# EAGLE design arduino-pro-mini_2-way-switches_v0.2.5_New-connector (EAGLE 7.2.0)
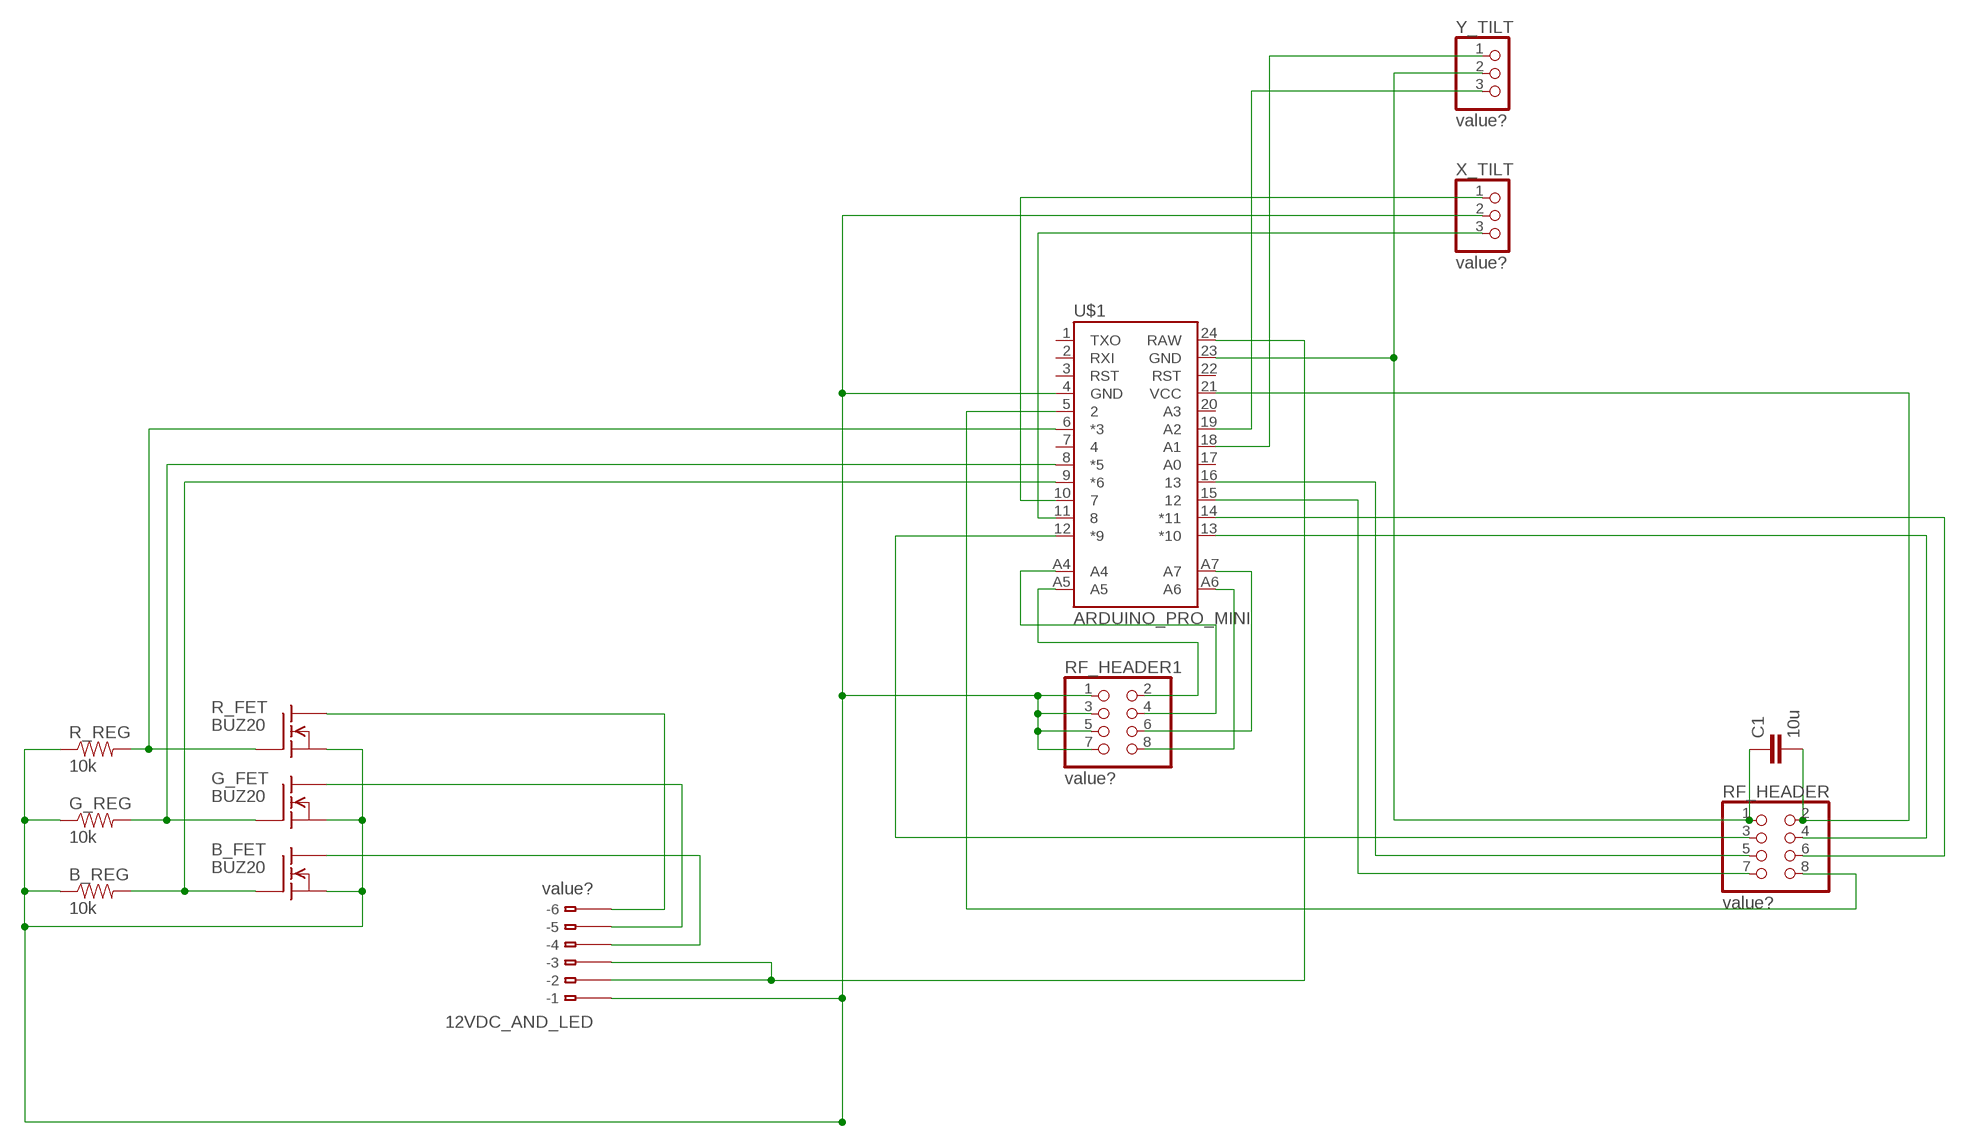
[diagram p0: schematic, sheet 1]

## Parts
12VDC_AND_LED  value?  234-206  [234-206]
B_FET  BUZ20  [TO220]
B_REG  10k  RESISTORPTH-1/4W  [AXIAL-0.4]
C1  10u  CAPPTH  [CAP-PTH-SMALL]
G_FET  BUZ20  [TO220]
G_REG  10k  RESISTORPTH-1/4W  [AXIAL-0.4]
R_FET  BUZ20  [TO220]
R_REG  10k  RESISTORPTH-1/4W  [AXIAL-0.4]
RF_HEADER  value?  PINHD-2X4  [2X04]
RF_HEADER1  value?  PINHD-2X4  [2X04]
U$1  ARDUINO_PRO_MINI  [ARDUINO_PRO_MINI]
X_TILT  value?  PINHD-1X3  [1X03]
Y_TILT  value?  PINHD-1X3  [1X03]

## Nets
N$1: U$1.10 X_TILT.1
N$2: B_FET.1(G) B_REG.P$2 U$1.9(*6)
N$3: R_FET.1(G) R_REG.P$2 U$1.6(*3)
N$4: 12VDC_AND_LED.B5(B-5) G_FET.2(D)
N$5: 12VDC_AND_LED.B4(B-4) B_FET.2(D)
N$6: U$1.11 X_TILT.3
N$7: 12VDC_AND_LED.B6(B-6) R_FET.2(D)
N$9: 12VDC_AND_LED.B2(B-2) 12VDC_AND_LED.B3(B-3) U$1.24(RAW)
N$10: C1.1 RF_HEADER.1 U$1.23(GND) Y_TILT.2
N$11: 12VDC_AND_LED.B1(B-1) B_FET.3(S) B_REG.P$1 G_FET.3(S) G_REG.P$1 R_FET.3(S) R_REG.P$1 RF_HEADER1.1 RF_HEADER1.3 RF_HEADER1.5 RF_HEADER1.7 U$1.4(GND) X_TILT.2
N$12: RF_HEADER1.4 U$1.A4
N$13: G_FET.1(G) G_REG.P$2 U$1.8(*5)
N$14: U$1.19(A2) Y_TILT.3
N$15: RF_HEADER.3 U$1.12(*9)
N$16: RF_HEADER.4 U$1.13(*10)
N$17: RF_HEADER.6 U$1.14(*11)
N$18: RF_HEADER1.2 U$1.A5
N$19: RF_HEADER1.8 U$1.A6
N$20: RF_HEADER1.6 U$1.A7
N$21: RF_HEADER.7 U$1.15
N$23: RF_HEADER.5 U$1.16
N$25: RF_HEADER.8 U$1.5
N$27: U$1.18(A1) Y_TILT.1
Y_TILT: C1.2 RF_HEADER.2 U$1.21(VCC)
Unconnected: 12VDC_AND_LED.A1(-1) 12VDC_AND_LED.A2(-2) 12VDC_AND_LED.A3(-3) 12VDC_AND_LED.A4(-4) 12VDC_AND_LED.A5(-5) 12VDC_AND_LED.A6(-6) U$1.1(TXO) U$1.2(RXI) U$1.3(RST) U$1.7 U$1.17(A0) U$1.20(A3) U$1.22(RST)

## Library data of the parts
12VDC_AND_LED = con-wago:234-206: WAGO Cage Clamp; MPN: 234-206; OC_FARNELL: unknown; OC_NEWARK: 28K9095
B_FET G_FET R_FET = transistor-fet:BUZ20: N-Channel Enhancement MOSFET 100V; 12A; 0,2Ohm
B_REG G_REG R_REG = SparkFun-Passives:RESISTOR: Resistor Basic schematic elements and footprints for 0603, 1206, and PTH resistors.
C1 = SparkFun-Passives:CAP: Capacitor Standard 0603 ceramic capacitor, and 0.1" leaded capacitor.
RF_HEADER RF_HEADER1 = rf-header:PINHD-2X4: PIN HEADER
U$1 = SparkFun-Boards:ARDUINO_PRO_MINI
X_TILT Y_TILT = pinhead:PINHD-1X3: PIN HEADER

## Board
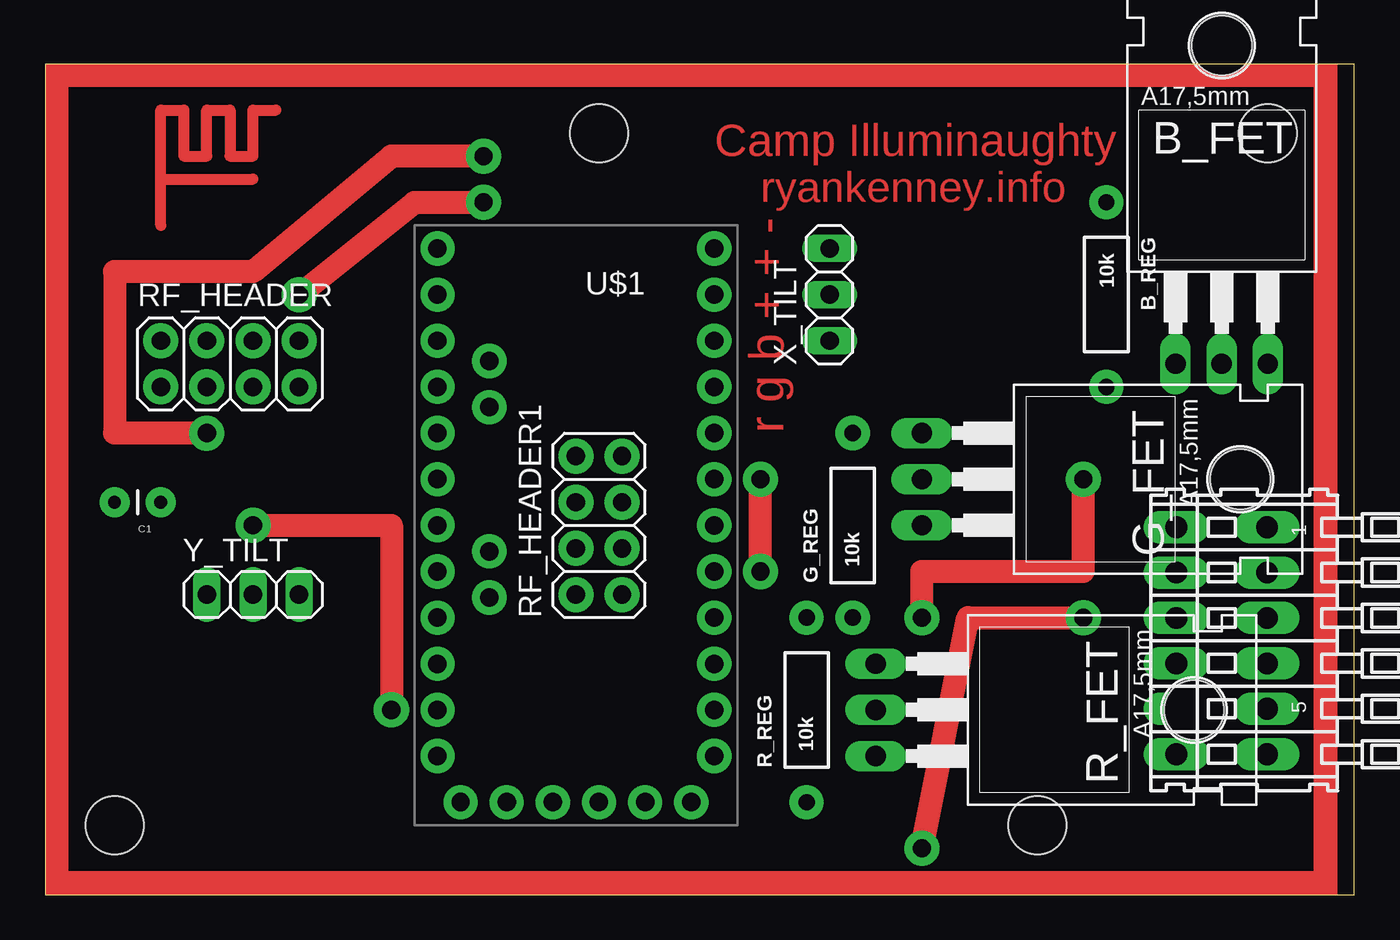
[diagram p1: board, top side]
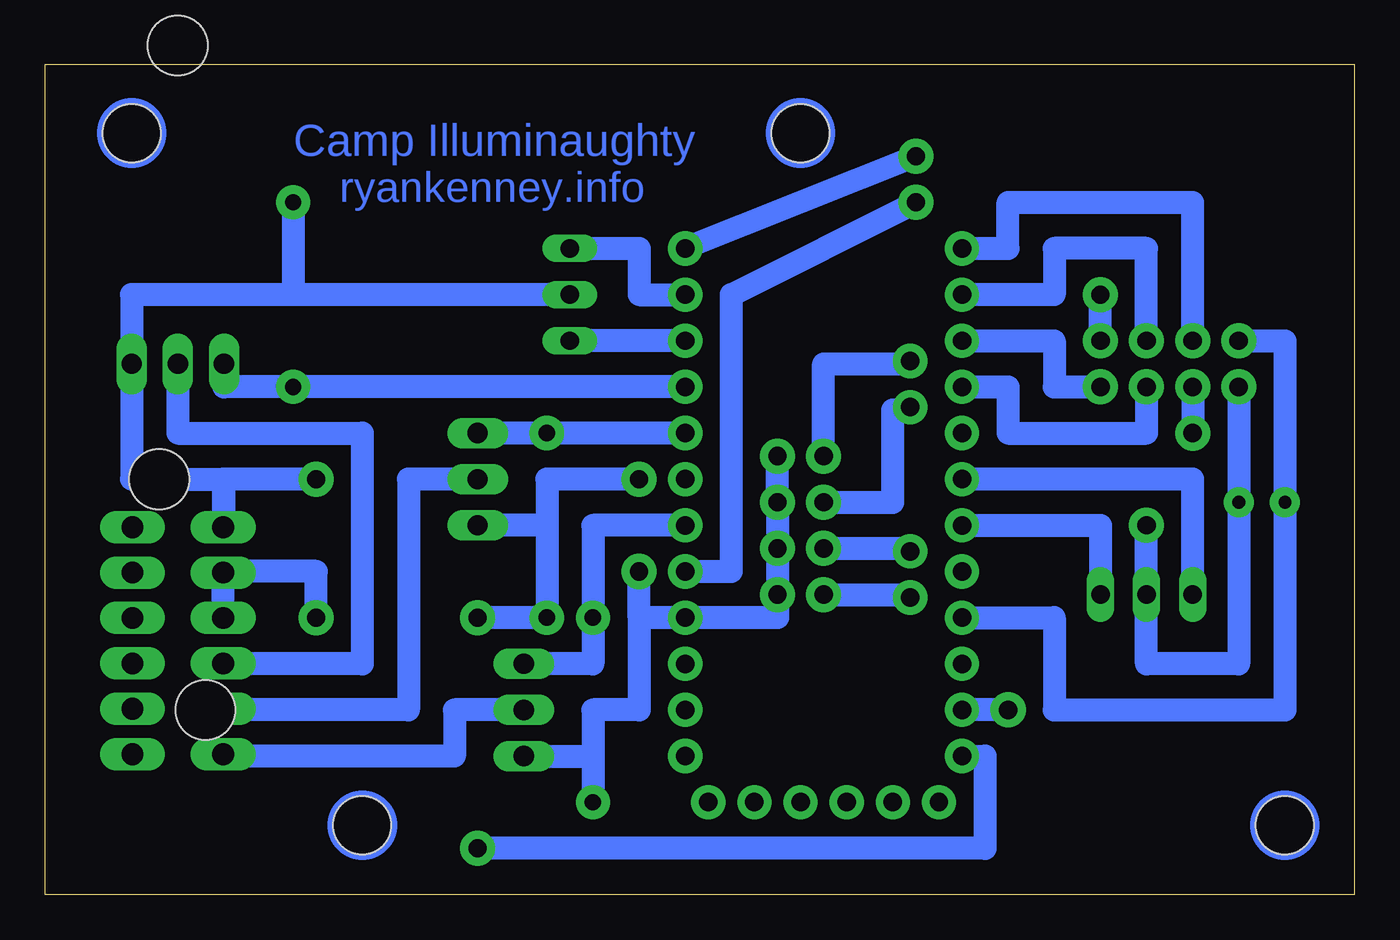
[diagram p2: board, bottom side, seen from below]

Size 72.06 x 45.71 mm. Coordinates in mm from the lower left corner, seen from the top.
Outline: 0,0 72.06,0 72.06,45.71 0,45.71 0,0
Copper layers (1*16): Top 0.035mm / dielectric 1.5mm / Bottom 0.035mm
Design rules "default": minimum track width 10mil, minimum drill 24mil, track to track 8mil, track to pad 8mil, pad to pad 8mil, via to via 8mil, smd to smd 8mil, copper to edge 40mil, drill to drill 8mil, minimum pad ring 10mil, minimum via ring 8mil, stop-mask expansion 4mil, vias tented up to drill 0mil, thermal gap 10mil
Holes 3.2 mm at 30.48,41.91 3.81,3.81 67.31,41.91 54.61,3.81

### Footprints (pad centres in the part's own frame; a part is rotated, then mirrored left to right if it is on the bottom)
234-206 = drill 1.2 long: A1 -6.25,2.5; A2 -3.75,2.5; A3 -1.25,2.5; A4 1.25,2.5; A5 3.75,2.5; A6 6.25,2.5; B1 -6.25,-2.5; B2 -3.75,-2.5; B3 -1.25,-2.5; B4 1.25,-2.5; B5 3.75,-2.5; B6 6.25,-2.5
TO220 = drill 1.118 long: 1 -2.54,-6.35; 2 0,-6.35; 3 2.54,-6.35 | hole 3.302: 0,11.176
AXIAL-0.4 = drill 0.9 pad 1.88: P$1 -5.08,0; P$2 5.08,0
CAP-PTH-SMALL = drill 0.7 pad 1.651: 1 0,0; 2 2.54,0
2X04 = drill 1.016 pad 1.93: 1 -3.81,-1.27; 2 -3.81,1.27; 3 -1.27,-1.27; 4 -1.27,1.27; 5 1.27,-1.27; 6 1.27,1.27; 7 3.81,-1.27; 8 3.81,1.27
ARDUINO_PRO_MINI = drill 1.016 pad 1.88: 1 -7.62,12.7; 2 -7.62,10.16; 3 -7.62,7.62; 4 -7.62,5.08; 5 -7.62,2.54; 6 -7.62,0; 7 -7.62,-2.54; 8 -7.62,-5.08; 9 -7.62,-7.62; 10 -7.62,-10.16; 11 -7.62,-12.7; 12 -7.62,-15.24; 13 7.62,-15.24; 14 7.62,-12.7; 15 7.62,-10.16; 16 7.62,-7.62; 17 7.62,-5.08; 18 7.62,-2.54; 19 7.62,0; 20 7.62,2.54; 21 7.62,5.08; 22 7.62,7.62; 23 7.62,10.16; 24 7.62,12.7; A4 4.763,1.429; A5 4.763,3.969; A6 4.763,-9.049; A7 4.763,-6.509; BLK -6.35,15.24; GND -3.81,15.24; GRN 6.35,15.24; RXI 1.27,15.24; TXO 3.81,15.24; VCC -1.27,15.24
1X03 = drill 1.016 long: 1 -2.54,0; 2 0,0; 3 2.54,0

### Placement (x,y rotation side)
12VDC_AND_LED  64.77,13.97 270 top
B_FET  64.77,35.56 0 top
B_REG  58.42,33.02 270 top
C1  6.35,21.59 180 top
G_FET  54.61,22.86 270 top
G_REG  44.45,20.32 90 top
R_FET  52.07,10.16 270 top
R_REG  41.91,10.16 90 top
RF_HEADER  10.16,29.21 0 top
RF_HEADER1  30.48,20.32 90 top
U$1  29.21,20.32 180 top
X_TILT  43.18,33.02 90 top
Y_TILT  11.43,16.51 0 top

### Tracks (layer width: path | path; a pad name or v marks a point on that pad's centre or on a via)
N$1
  Bottom 1.27: U$1.10 X_TILT.1
N$2
  Bottom 1.27: U$1.9 B_REG.P$2 62.23,27.94 B_FET.1
N$3
  Bottom 1.27: U$1.6 41.91,20.32 R_REG.P$2 41.91,12.7 R_FET.1
N$4
  Bottom 1.27: G_FET.2 52.07,22.86 52.07,10.16 62.27,10.16 12VDC_AND_LED.B5
N$5
  Bottom 1.27: B_FET.2 64.77,25.4 54.61,25.4 54.61,12.7 62.27,12.7 12VDC_AND_LED.B4
N$6
  Bottom 1.27: X_TILT.3 39.37,35.56 39.37,33.02 U$1.11
N$7
  Bottom 1.27: R_FET.2 49.53,10.16 49.53,7.62 62.27,7.62 12VDC_AND_LED.B6
N$8
  Top 0.61: 6.35,39.37 6.35,43.18 7.62,43.18 7.62,40.64 8.89,40.64 8.89,43.18 10.16,43.18 10.16,40.64 11.43,40.64 11.43,43.18 12.7,43.18 | 6.35,36.83 6.35,39.37 | 6.35,39.37 11.43,39.37
N$9  (via drill 1 pad 1.93)
  Top 1.27: v48.26,2.54 50.8,15.24 v57.15,15.24
  Bottom 1.27: U$1.24 20.32,7.62 20.32,2.54 v48.26,2.54 | v57.15,15.24 57.15,17.78 62.27,17.78 12VDC_AND_LED.B2 12VDC_AND_LED.B3
N$10  (via drill 1 pad 1.93)
  Top 1.27: v11.43,20.32 19.05,20.32 v19.05,10.16
  Bottom 1.27: RF_HEADER.1 C1.1 6.35,12.7 11.43,12.7 Y_TILT.2 v11.43,20.32 | v19.05,10.16 U$1.23
N$11  (via drill 1 pad 1.93)
  Top 1.27: v39.37,17.78 v39.37,22.86 | v48.26,15.24 48.26,17.78 57.15,17.78 v57.15,22.86
  Bottom 1.27: RF_HEADER1.7 RF_HEADER1.5 RF_HEADER1.3 RF_HEADER1.1 31.75,15.24 U$1.4 39.37,15.24 | 44.45,20.32 G_FET.3 | R_FET.3 41.91,7.62 | 41.91,7.62 R_REG.P$1 | 39.37,15.24 39.37,10.16 41.91,10.16 41.91,7.62 | B_REG.P$1 58.42,33.02 | 58.42,33.02 67.31,33.02 B_FET.3 67.31,22.86 62.27,22.86 62.27,20.32 | X_TILT.2 58.42,33.02 | 39.37,15.24 v39.37,17.78 | v39.37,22.86 44.45,22.86 44.45,20.32 | 44.45,20.32 G_REG.P$1 v48.26,15.24 | v57.15,22.86 62.23,22.86 62.27,20.32 | 62.27,20.32 12VDC_AND_LED.B1
N$12
  Bottom 1.27: RF_HEADER1.4 24.61,19.05 U$1.A4
N$13
  Bottom 1.27: U$1.8 G_REG.P$2 G_FET.1
N$14
  Bottom 1.27: U$1.19 13.97,20.32 Y_TILT.3
N$15  (via drill 1 pad 1.93)
  Top 1.27: v8.89,25.4 3.81,25.4 3.81,34.29 11.43,34.29 19.05,40.64 v24.13,40.64
  Bottom 1.27: RF_HEADER.3 v8.89,25.4 | v24.13,40.64 U$1.12
N$16
  Bottom 1.27: U$1.13 19.05,35.56 19.05,38.1 8.89,38.1 RF_HEADER.4
N$17
  Bottom 1.27: U$1.14 16.51,33.02 16.51,35.56 11.43,35.56 RF_HEADER.6
N$18
  Bottom 1.27: RF_HEADER1.2 24.61,16.51 U$1.A5
N$19
  Bottom 1.27: RF_HEADER1.8 29.21,29.21 24.61,29.21 U$1.A6
N$20
  Bottom 1.27: RF_HEADER1.6 25.4,21.59 25.4,26.67 24.61,26.67 U$1.A7
N$21
  Bottom 1.27: U$1.15 16.51,30.48 16.51,27.94 RF_HEADER.7
N$23
  Bottom 1.27: U$1.16 19.05,27.94 19.05,25.4 11.43,25.4 RF_HEADER.5
N$25  (via drill 1 pad 1.93)
  Top 1.27: v13.97,33.02 20.32,38.1 v24.13,38.1
  Bottom 1.27: RF_HEADER.8 v13.97,33.02 | U$1.5 34.29,17.78 34.29,33.02 v24.13,38.1
N$27
  Bottom 1.27: Y_TILT.1 8.89,22.86 U$1.18
Y_TILT
  Bottom 1.27: U$1.21 16.51,15.24 16.51,10.16 3.81,10.16 C1.2 3.81,30.48 RF_HEADER.2
(copper drawn outside any net)
  shapes: Bottom circle x4, Top area x4

### Text on the board
Top: Camp Illuminaughty | ryankenney.info | r g b + + -
Bottom: Camp Illuminaughty | ryankenney.info